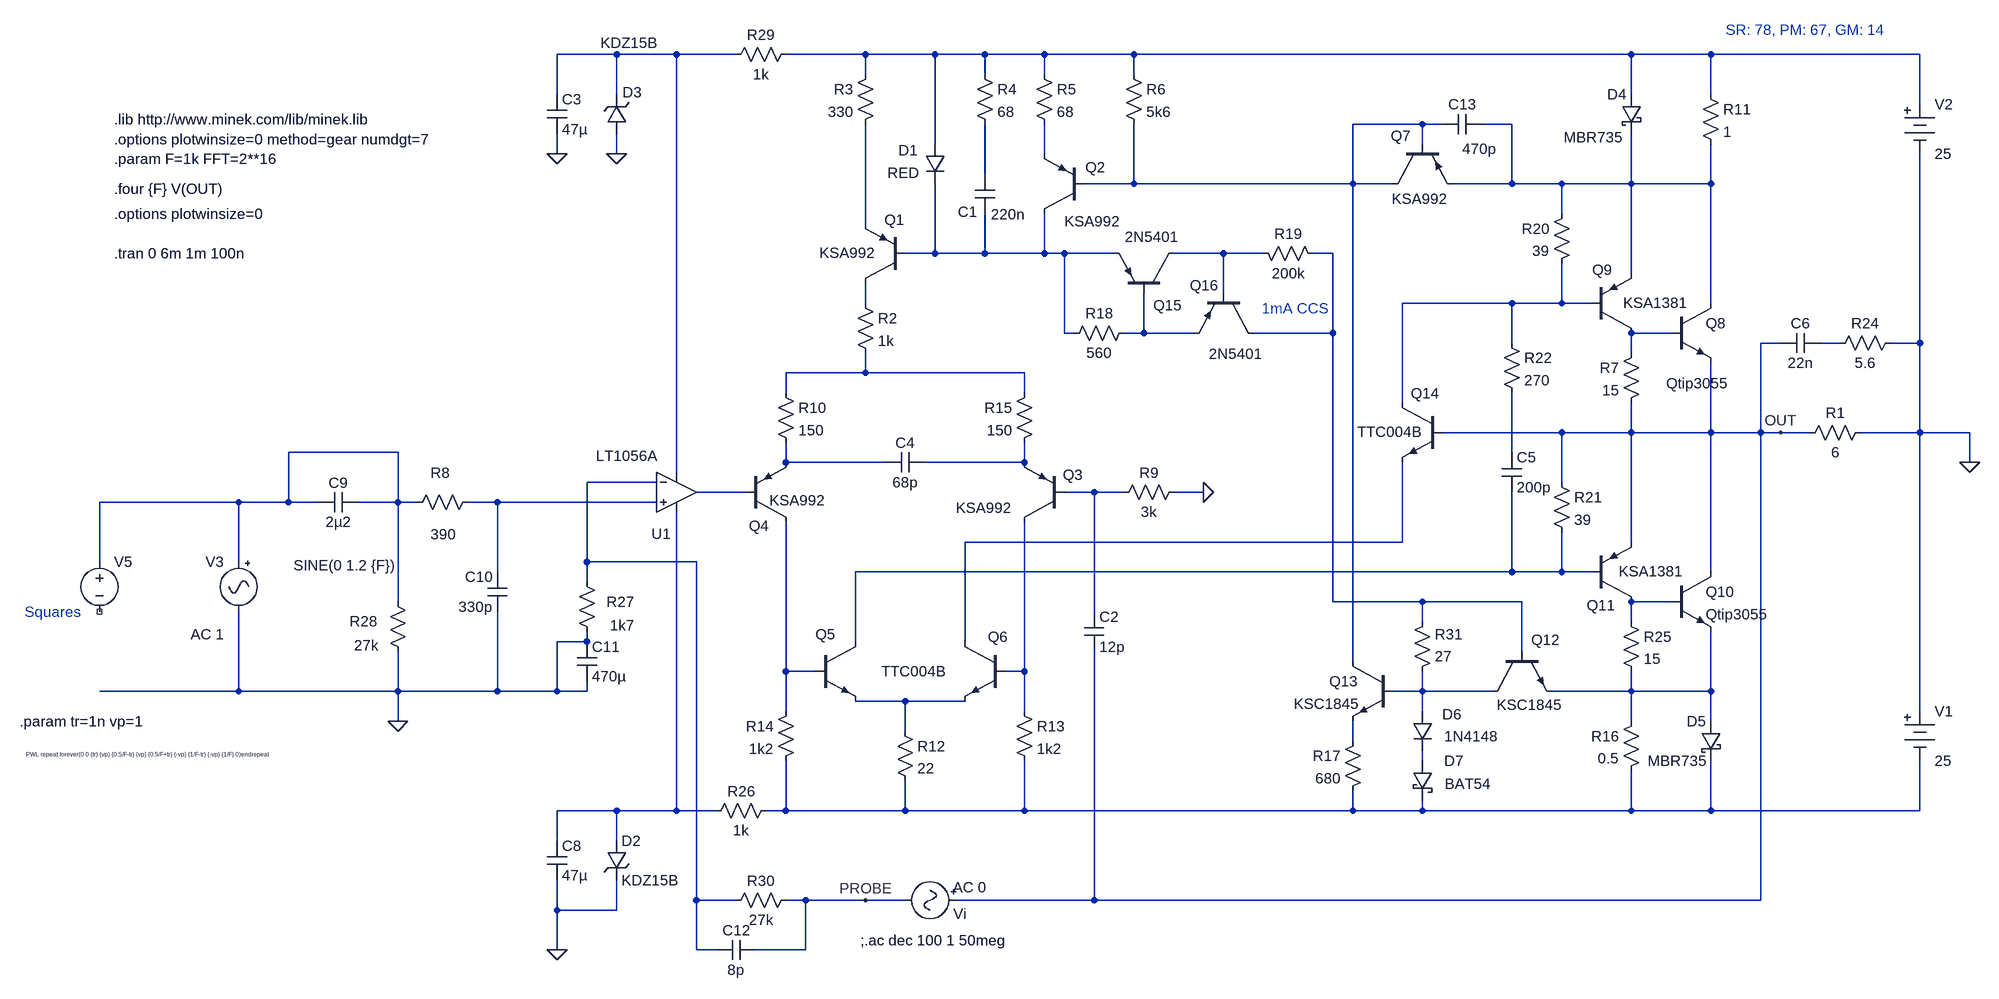
[diagram p0: schematic op_circlo_namp.3055.41.asc]
op_circlo_namp.3055.41.asc, the LTspice schematic file:
Version 4
SHEET 1 1932 832
WIRE -2048 -880 -2144 -880
WIRE -1952 -880 -2048 -880
WIRE -1856 -880 -1952 -880
WIRE -1648 -880 -1776 -880
WIRE -1536 -880 -1648 -880
WIRE -1456 -880 -1536 -880
WIRE -1360 -880 -1456 -880
WIRE -1216 -880 -1360 -880
WIRE -416 -880 -1216 -880
WIRE -288 -880 -416 -880
WIRE 48 -880 -288 -880
WIRE -1648 -848 -1648 -880
WIRE -1456 -848 -1456 -880
WIRE -1360 -848 -1360 -880
WIRE -1216 -848 -1216 -880
WIRE -2144 -816 -2144 -880
WIRE -2048 -816 -2048 -880
WIRE -416 -816 -416 -880
WIRE -288 -816 -288 -880
WIRE 48 -800 48 -880
WIRE -752 -768 -864 -768
WIRE -720 -768 -752 -768
WIRE -608 -768 -656 -768
WIRE -1536 -736 -1536 -880
WIRE -752 -736 -752 -768
WIRE -2144 -720 -2144 -752
WIRE -2048 -720 -2048 -752
WIRE -1360 -720 -1360 -768
WIRE -1456 -688 -1456 -768
WIRE -1216 -672 -1216 -768
WIRE -1216 -672 -1296 -672
WIRE -864 -672 -864 -768
WIRE -864 -672 -1216 -672
WIRE -800 -672 -864 -672
WIRE -608 -672 -608 -768
WIRE -608 -672 -704 -672
WIRE -528 -672 -608 -672
WIRE -416 -672 -416 -752
WIRE -416 -672 -528 -672
WIRE -288 -672 -288 -736
WIRE -288 -672 -416 -672
WIRE -528 -624 -528 -672
WIRE -1648 -608 -1648 -768
WIRE -1536 -560 -1536 -672
WIRE -1536 -560 -1584 -560
WIRE -1456 -560 -1456 -624
WIRE -1456 -560 -1536 -560
WIRE -1360 -560 -1360 -624
WIRE -1360 -560 -1456 -560
WIRE -1328 -560 -1360 -560
WIRE -1248 -560 -1328 -560
WIRE -1072 -560 -1152 -560
WIRE -1008 -560 -1072 -560
WIRE -896 -560 -928 -560
WIRE -416 -528 -416 -672
WIRE -1072 -496 -1072 -560
WIRE -1648 -480 -1648 -512
WIRE -608 -480 -784 -480
WIRE -528 -480 -528 -544
WIRE -528 -480 -608 -480
WIRE -480 -480 -528 -480
WIRE -288 -480 -288 -672
WIRE -1328 -432 -1328 -560
WIRE -1312 -432 -1328 -432
WIRE -1200 -432 -1200 -496
WIRE -1200 -432 -1232 -432
WIRE -1120 -432 -1200 -432
WIRE -896 -432 -896 -560
WIRE -896 -432 -1024 -432
WIRE -352 -432 -416 -432
WIRE -608 -416 -608 -480
WIRE -176 -416 -208 -416
WIRE -80 -416 -112 -416
WIRE 48 -416 48 -720
WIRE 48 -416 0 -416
WIRE -416 -400 -416 -432
WIRE -1648 -368 -1648 -400
WIRE -1648 -368 -1776 -368
WIRE -1392 -368 -1648 -368
WIRE -1776 -336 -1776 -368
WIRE -1392 -336 -1392 -368
WIRE -784 -320 -784 -480
WIRE -528 -272 -720 -272
WIRE -416 -272 -416 -320
WIRE -416 -272 -528 -272
WIRE -288 -272 -288 -384
WIRE -288 -272 -416 -272
WIRE -208 -272 -208 -416
WIRE -208 -272 -288 -272
WIRE -176 -272 -208 -272
WIRE -128 -272 -176 -272
WIRE 48 -272 48 -416
WIRE 48 -272 -48 -272
WIRE 128 -272 48 -272
WIRE -2400 -240 -2576 -240
WIRE -608 -240 -608 -336
WIRE -1776 -224 -1776 -256
WIRE -1616 -224 -1776 -224
WIRE -1392 -224 -1392 -256
WIRE -1392 -224 -1552 -224
WIRE 128 -224 128 -272
WIRE -1952 -208 -1952 -880
WIRE -1984 -192 -2096 -192
WIRE -528 -192 -528 -272
WIRE -1840 -176 -1920 -176
WIRE -1280 -176 -1328 -176
WIRE -1232 -176 -1280 -176
WIRE -1104 -176 -1152 -176
WIRE -2656 -160 -2880 -160
WIRE -2576 -160 -2576 -240
WIRE -2576 -160 -2656 -160
WIRE -2528 -160 -2576 -160
WIRE -2400 -160 -2400 -240
WIRE -2400 -160 -2464 -160
WIRE -2368 -160 -2400 -160
WIRE -2240 -160 -2288 -160
WIRE -1984 -160 -2240 -160
WIRE -784 -96 -784 -224
WIRE -784 -96 -1488 -96
WIRE -416 -96 -416 -272
WIRE -2880 -64 -2880 -160
WIRE -2656 -64 -2656 -160
WIRE -2096 -64 -2096 -192
WIRE -1920 -64 -2096 -64
WIRE -2240 -48 -2240 -160
WIRE -608 -48 -608 -176
WIRE -608 -48 -1664 -48
WIRE -528 -48 -528 -112
WIRE -528 -48 -608 -48
WIRE -480 -48 -528 -48
WIRE -288 -48 -288 -272
WIRE -2096 -32 -2096 -64
WIRE -2400 0 -2400 -160
WIRE -896 0 -896 -432
WIRE -752 0 -896 0
WIRE -592 0 -752 0
WIRE -352 0 -416 0
WIRE -1280 16 -1280 -176
WIRE -752 32 -752 0
WIRE -416 32 -416 0
WIRE -2096 64 -2096 48
WIRE -2096 64 -2144 64
WIRE -1664 64 -1664 -48
WIRE -1488 64 -1488 -96
WIRE -592 80 -592 0
WIRE -864 96 -864 -672
WIRE -1776 112 -1776 -128
WIRE -1728 112 -1776 112
WIRE -1392 112 -1392 -128
WIRE -1392 112 -1424 112
WIRE -2656 144 -2656 16
WIRE -2656 144 -2880 144
WIRE -2400 144 -2400 80
WIRE -2400 144 -2656 144
WIRE -2240 144 -2240 16
WIRE -2240 144 -2400 144
WIRE -2144 144 -2144 64
WIRE -2144 144 -2240 144
WIRE -2096 144 -2096 128
WIRE -2096 144 -2144 144
WIRE -752 144 -752 112
WIRE -752 144 -800 144
WIRE -640 144 -752 144
WIRE -416 144 -416 112
WIRE -416 144 -544 144
WIRE -288 144 -288 48
WIRE -288 144 -416 144
WIRE -1584 160 -1664 160
WIRE -1488 160 -1584 160
WIRE -1776 176 -1776 112
WIRE -1392 176 -1392 112
WIRE -752 176 -752 144
WIRE 48 176 48 -272
WIRE -2400 192 -2400 144
WIRE -416 192 -416 144
WIRE -288 192 -288 144
WIRE -1584 208 -1584 160
WIRE -864 224 -864 192
WIRE -752 256 -752 240
WIRE -2048 336 -2144 336
WIRE -1952 336 -1952 -144
WIRE -1952 336 -2048 336
WIRE -1888 336 -1952 336
WIRE -1776 336 -1776 256
WIRE -1776 336 -1808 336
WIRE -1584 336 -1584 288
WIRE -1584 336 -1776 336
WIRE -1392 336 -1392 256
WIRE -1392 336 -1584 336
WIRE -864 336 -864 304
WIRE -864 336 -1392 336
WIRE -752 336 -752 320
WIRE -752 336 -864 336
WIRE -416 336 -416 272
WIRE -416 336 -752 336
WIRE -288 336 -288 256
WIRE -288 336 -416 336
WIRE 48 336 48 256
WIRE 48 336 -288 336
WIRE -2144 384 -2144 336
WIRE -2048 384 -2048 336
WIRE -1920 480 -1920 -64
WIRE -1856 480 -1920 480
WIRE -1744 480 -1776 480
WIRE -1648 480 -1744 480
WIRE -1584 480 -1648 480
WIRE -1280 480 -1280 80
WIRE -1280 480 -1504 480
WIRE -208 480 -208 -272
WIRE -208 480 -1280 480
WIRE -2144 496 -2144 448
WIRE -2048 496 -2048 448
WIRE -2048 496 -2144 496
WIRE -2144 560 -2144 496
WIRE -1920 560 -1920 480
WIRE -1888 560 -1920 560
WIRE -1744 560 -1744 480
WIRE -1744 560 -1824 560
FLAG 128 -224 0
FLAG -1104 -176 0
FLAG -176 -272 OUT
FLAG -2400 192 0
FLAG -2048 -720 0
FLAG -2144 -720 0
FLAG -2144 560 0
FLAG -1648 480 PROBE
SYMBOL res -32 -288 R90
WINDOW 0 0 56 VBottom 2
WINDOW 3 32 56 VTop 2
SYMATTR InstName R1
SYMATTR Value 6
SYMBOL res -1664 -496 R0
SYMATTR InstName R2
SYMATTR Value 1k
SYMBOL res -1632 -864 M0
SYMATTR InstName R3
SYMATTR Value 330
SYMBOL res -1472 -864 R0
SYMATTR InstName R4
SYMATTR Value 68
SYMBOL res -1376 -864 R0
SYMATTR InstName R5
SYMATTR Value 68
SYMBOL cap -1472 -688 R0
WINDOW 0 -27 61 Left 2
WINDOW 3 26 65 Left 2
SYMATTR InstName C1
SYMATTR Value 220n
SYMBOL res -1232 -864 R0
SYMATTR InstName R6
SYMATTR Value 5k6
SYMBOL res -1248 -160 R270
WINDOW 0 32 56 VTop 2
WINDOW 3 0 56 VBottom 2
SYMATTR InstName R9
SYMATTR Value 3k
SYMBOL res -304 -832 R0
SYMATTR InstName R11
SYMATTR Value 1
SYMBOL res -1600 192 R0
SYMATTR InstName R12
SYMATTR Value 22
SYMBOL res -1408 160 R0
SYMATTR InstName R13
SYMATTR Value 1k2
SYMBOL res -400 176 M0
SYMATTR InstName R16
SYMATTR Value 0.5
SYMBOL res -848 208 M0
SYMATTR InstName R17
SYMATTR Value 680
SYMBOL res -512 -640 M0
SYMATTR InstName R20
SYMATTR Value 39
SYMBOL res -544 -208 R0
SYMATTR InstName R21
SYMATTR Value 39
SYMBOL res -624 -432 R0
SYMATTR InstName R22
SYMATTR Value 270
SYMBOL cap -624 -240 R0
SYMATTR InstName C5
SYMATTR Value 200p
SYMBOL res 16 -432 R90
WINDOW 0 0 56 VBottom 2
WINDOW 3 32 56 VTop 2
SYMATTR InstName R24
SYMATTR Value 5.6
SYMBOL cap -112 -432 R90
WINDOW 0 0 32 VBottom 2
WINDOW 3 32 32 VTop 2
SYMATTR InstName C6
SYMATTR Value 22n
SYMBOL res -1760 160 M0
SYMATTR InstName R14
SYMATTR Value 1k2
SYMBOL npn -640 80 M90
WINDOW 0 -19 109 VLeft 2
WINDOW 3 86 110 VLeft 2
SYMATTR InstName Q12
SYMATTR Value KSC1845
SYMBOL pnp -1328 -128 R180
WINDOW 0 2 76 Right 2
WINDOW 3 174 23 Right 2
SYMATTR InstName Q3
SYMATTR Value KSA992
SYMBOL pnp -1840 -128 M180
WINDOW 0 5 -6 Left 2
WINDOW 3 38 35 Left 2
SYMATTR InstName Q4
SYMATTR Value KSA992
SYMBOL pnp -1584 -512 R180
WINDOW 0 33 102 Right 2
WINDOW 3 138 49 Right 2
SYMATTR InstName Q1
SYMATTR Value KSA992
SYMBOL npn -1728 64 R0
WINDOW 3 106 48 Left 2
WINDOW 0 0 -12 Left 2
SYMATTR Value TTC004B
SYMATTR InstName Q5
SYMBOL npn -1424 64 M0
WINDOW 3 -12 115 Invisible 2
WINDOW 0 -5 -8 Left 2
SYMATTR Value TTC004B
SYMATTR InstName Q6
SYMBOL npn -800 96 M0
SYMATTR InstName Q13
SYMATTR Value KSC1845
SYMBOL diode -768 176 R0
WINDOW 0 48 5 Left 2
WINDOW 3 51 40 Left 2
SYMATTR InstName D6
SYMATTR Value 1N4148
SYMBOL schottky -768 256 R0
WINDOW 0 51 0 Left 2
WINDOW 3 52 37 Left 2
SYMATTR InstName D7
SYMATTR Value BAT54
SYMBOL pnp -1296 -624 R180
WINDOW 0 -2 75 Right 2
WINDOW 3 32 -12 Right 2
SYMATTR InstName Q2
SYMATTR Value KSA992
SYMBOL schottky -400 -816 M0
WINDOW 3 31 69 Left 2
SYMATTR Value MBR735
SYMATTR InstName D4
SYMBOL schottky -272 192 M0
SYMATTR InstName D5
SYMATTR Value MBR735
SYMBOL diode -1520 -736 M0
WINDOW 3 42 46 Left 2
WINDOW 0 44 10 Left 2
SYMATTR Value RED
SYMATTR InstName D1
SYMBOL pnp -1024 -496 R90
WINDOW 0 -13 56 VRight 2
WINDOW 3 97 -13 VRight 2
SYMATTR InstName Q16
SYMATTR Value 2N5401
SYMBOL res -1328 -416 R270
WINDOW 0 32 56 VTop 2
WINDOW 3 0 56 VBottom 2
SYMATTR InstName R18
SYMATTR Value 560
SYMBOL pnp -1152 -496 M270
WINDOW 0 -19 -13 VRight 2
WINDOW 3 91 -6 VRight 2
SYMATTR InstName Q15
SYMATTR Value 2N5401
SYMBOL res -1024 -576 M90
WINDOW 0 0 56 VBottom 2
WINDOW 3 32 56 VTop 2
SYMATTR InstName R19
SYMATTR Value 200k
SYMBOL pnp -480 -432 M180
WINDOW 0 33 102 Right 2
WINDOW 3 152 49 Right 2
SYMATTR InstName Q9
SYMATTR Value KSA1381
SYMBOL res -400 -416 M0
SYMATTR InstName R7
SYMATTR Value 15
SYMBOL npn -352 -480 R0
WINDOW 3 -8 129 Left 2
SYMATTR Value Qtip3055
SYMATTR InstName Q8
SYMBOL pnp -480 0 M180
WINDOW 0 38 -6 Right 2
WINDOW 3 145 49 Right 2
SYMATTR InstName Q11
SYMATTR Value KSA1381
SYMBOL npn -352 -48 R0
SYMATTR InstName Q10
SYMATTR Value Qtip3055
SYMBOL res -432 16 R0
SYMATTR InstName R25
SYMATTR Value 15
SYMBOL pnp -800 -736 M90
WINDOW 0 -13 -3 VRight 2
WINDOW 3 88 -1 VRight 2
SYMATTR InstName Q7
SYMATTR Value KSA992
SYMBOL Misc\\battery 48 -816 R0
WINDOW 123 0 0 Left 2
WINDOW 39 0 0 Left 2
SYMATTR InstName V2
SYMATTR Value 25
SYMBOL Misc\\battery 48 160 R0
WINDOW 123 0 0 Left 2
WINDOW 39 0 0 Left 2
SYMATTR InstName V1
SYMATTR Value 25
SYMBOL npn -720 -320 M0
WINDOW 3 33 47 Left 2
WINDOW 0 5 -15 Left 2
SYMATTR Value TTC004B
SYMATTR InstName Q14
SYMBOL Misc\\signal -2656 -80 M0
WINDOW 123 24 132 Left 2
WINDOW 39 0 0 Left 2
WINDOW 3 -253 21 Left 2
SYMATTR Value2 AC 1
SYMATTR Value SINE(0 1.2 {F})
SYMATTR InstName V3
SYMBOL zener -2032 -752 R180
WINDOW 0 -24 67 Left 2
WINDOW 3 -49 147 Left 2
SYMATTR InstName D3
SYMATTR Value KDZ15B
SYMATTR Description Diode
SYMATTR Type diode
SYMBOL cap -2160 -816 R0
SYMATTR InstName C3
SYMATTR Value 47µ
SYMBOL zener -2064 384 R0
SYMATTR InstName D2
SYMATTR Value KDZ15B
SYMATTR Description Diode
SYMATTR Type diode
SYMBOL cap -2160 448 M180
WINDOW 0 24 56 Left 2
WINDOW 3 24 8 Left 2
SYMATTR InstName C8
SYMATTR Value 47µ
SYMBOL cap -2464 -176 R90
WINDOW 0 0 32 VBottom 2
WINDOW 3 32 32 VTop 2
SYMATTR InstName C9
SYMATTR Value 2µ2
SYMBOL Opamps\\LT1056A -1952 -240 R0
WINDOW 0 -40 131 Left 2
WINDOW 3 -129 5 Left 2
SYMATTR InstName U1
SYMBOL res -2272 -176 R90
WINDOW 0 -16 60 VBottom 2
WINDOW 3 52 55 VTop 2
SYMATTR InstName R8
SYMATTR Value 390
SYMATTR SpiceLine pwr=1
SYMBOL res -2080 64 R180
WINDOW 0 -60 64 Left 2
WINDOW 3 -60 26 Left 2
SYMATTR InstName R27
SYMATTR Value 1k7
SYMATTR SpiceLine pwr=1
SYMBOL cap -2224 -48 M0
SYMATTR InstName C10
SYMATTR Value 330p
SYMBOL res -2384 96 R180
WINDOW 0 49 65 Left 2
WINDOW 3 47 26 Left 2
SYMATTR InstName R28
SYMATTR Value 27k
SYMATTR SpiceLine pwr=1
SYMBOL voltage -2880 -80 R0
WINDOW 3 -118 326 Left 0
SYMATTR Value PWL repeat forever(0 0 {tr} {vp} {0.5/F-tr} {vp} {0.5/F+tr} {-vp} {1/F-tr} {-vp} {1/F} 0)endrepeat
SYMATTR InstName V5
SYMBOL cap -2112 64 R0
SYMATTR InstName C11
SYMATTR Value 470µ
SYMBOL res -1792 320 R90
WINDOW 0 0 56 VBottom 2
WINDOW 3 32 56 VTop 2
SYMATTR InstName R26
SYMATTR Value 1k
SYMATTR SpiceLine pwr=1
SYMBOL res -1760 -896 R90
WINDOW 0 0 56 VBottom 2
WINDOW 3 32 56 VTop 2
SYMATTR InstName R29
SYMATTR Value 1k
SYMATTR SpiceLine pwr=1
SYMBOL res -1760 464 R90
WINDOW 0 0 56 VBottom 2
WINDOW 3 32 56 VTop 2
SYMATTR InstName R30
SYMATTR Value 27k
SYMBOL Misc\\signal -1488 480 R90
WINDOW 123 -21 19 VLeft 2
WINDOW 3 24 104 Invisible 2
WINDOW 0 22 18 VLeft 2
WINDOW 39 0 0 Left 0
SYMATTR Value2 AC 0
SYMATTR Value 0
SYMATTR InstName Vi
SYMBOL cap -1824 544 R90
WINDOW 0 0 32 VBottom 2
WINDOW 3 32 32 VTop 2
SYMATTR InstName C12
SYMATTR Value 8p
SYMBOL cap -1296 16 R0
SYMATTR InstName C2
SYMATTR Value 12p
SYMBOL res -1792 -352 R0
SYMATTR InstName R10
SYMATTR Value 150
SYMATTR SpiceLine pwr=1
SYMBOL res -1376 -352 M0
SYMATTR InstName R15
SYMATTR Value 150
SYMATTR SpiceLine pwr=1
SYMBOL cap -1552 -240 R90
WINDOW 0 0 32 VBottom 2
WINDOW 3 32 32 VTop 2
SYMATTR InstName C4
SYMATTR Value 68p
SYMBOL res -768 128 M180
WINDOW 0 36 76 Left 2
WINDOW 3 36 40 Left 2
SYMATTR InstName R31
SYMATTR Value 27
SYMBOL cap -656 -784 R90
WINDOW 0 0 32 VBottom 2
WINDOW 3 40 5 VTop 2
SYMATTR InstName C13
SYMATTR Value 470p
TEXT -904 -472 Right 2 ;1mA CCS
TEXT -2856 -776 Left 2 !.lib http://www.minek.com/lib/minek.lib
TEXT -2856 -560 Left 2 !.tran 0 6m 1m 100n
TEXT -2856 -624 Left 2 !.options plotwinsize=0
TEXT -2856 -664 Left 2 !.four {F} V(OUT)
TEXT -3008 192 Left 2 !.param tr=1n vp=1
TEXT -3000 16 Left 2 ;Squares
TEXT -2856 -712 Left 2 !.param F=1k FFT=2**16
TEXT -2856 -744 Left 2 !.options plotwinsize=0 method=gear numdgt=7
TEXT -1656 544 Left 2 !;.ac dec 100 1 50meg
TEXT -264 -920 Left 2 ;SR: 78, PM: 67, GM: 14

The netlist it stands for:
* op_circlo_namp.3055.41.asc
R1 0 OUT 6
R2 N011 N016 1k
R3 N002 N007 330
R4 N002 N006 68
R5 N002 N005 68
C1 N006 N008 220n
R6 N002 N003 5k6
R9 N023 0 3k
R11 N002 N004 1
R12 N032 N036 22
R13 N029 N036 1k2
R16 N031 N036 0.5
R17 N033 N036 680
R20 N004 N012 39
R21 OUT N026 39
R22 N012 N018 270
C5 N018 N026 200p
R24 0 N015 5.6
C6 N015 OUT 22n
R14 N028 N036 1k2
Q12 N030 N010 N031 0 KSC1845
Q3 N029 N023 N020 0 KSA992
Q4 N028 N022 N019 0 KSA992
Q1 N011 N008 N007 0 KSA992
Q5 N026 N028 N032 0 TTC004B
Q6 N025 N029 N032 0 TTC004B
Q13 N003 N030 N033 0 KSC1845
D6 N030 N034 1N4148
D7 N034 N036 BAT54
Q2 N008 N003 N005 0 KSA992
D4 N002 N004 MBR735
D5 N031 N036 MBR735
D1 N002 N008 RED
Q16 N010 N009 N013 0 2N5401
R18 N008 N013 560
Q15 N009 N013 N008 0 2N5401
R19 N009 N010 200k
Q9 N014 N012 N004 0 KSA1381
R7 N014 OUT 15
Q8 N004 N014 OUT 0 Qtip3055
Q11 N027 N026 OUT 0 KSA1381
Q10 OUT N027 N031 0 Qtip3055
R25 N027 N031 15
Q7 N003 N003 N004 0 KSA992
V2 N002 0 25
V1 0 N036 25
Q14 N012 OUT N025 0 TTC004B
V3 N017 0 SINE(0 1.2 {F}) AC 1
D3 0 N001 KDZ15B
C3 N001 0 47µ
D2 N035 0 KDZ15B
C8 0 N035 47µ
C9 N017 N017 2µ2
XU1 N024 N021 N001 N035 N022 LT1056A  ; pins In+ In- V+ V- OUT
R8 N024 N017 390 pwr=1
R27 0 N021 1k7 pwr=1
C10 N024 0 330p
R28 0 N017 27k pwr=1
V5 N017 NC_01 PWL repeat forever(0 0 {tr} {vp} {0.5/F-tr} {vp} {0.5/F+tr} {-vp} {1/F-tr} {-vp} {1/F} 0)endrepeat
C11 0 0 470µ
R26 N036 N035 1k pwr=1
R29 N002 N001 1k pwr=1
R30 PROBE N021 27k
Vi OUT PROBE 0 AC 0
C12 PROBE N021 8p
C2 N023 OUT 12p
R10 N016 N019 150 pwr=1
R15 N016 N020 150 pwr=1
C4 N020 N019 68p
R31 N030 N010 27
C13 N004 N003 470p
.model D D
.lib standard.dio
.model NPN NPN
.model PNP PNP
.lib standard.bjt
* 1mA CCS
.lib http://www.minek.com/lib/minek.lib
.tran 0 6m 1m 100n
.options plotwinsize=0
.four {F} V(OUT)
.param tr=1n vp=1
* Squares
.param F=1k FFT=2**16
.options plotwinsize=0 method=gear numdgt=7
;.ac dec 100 1 50meg
* SR: 78, PM: 67, GM: 14
.backanno
.end